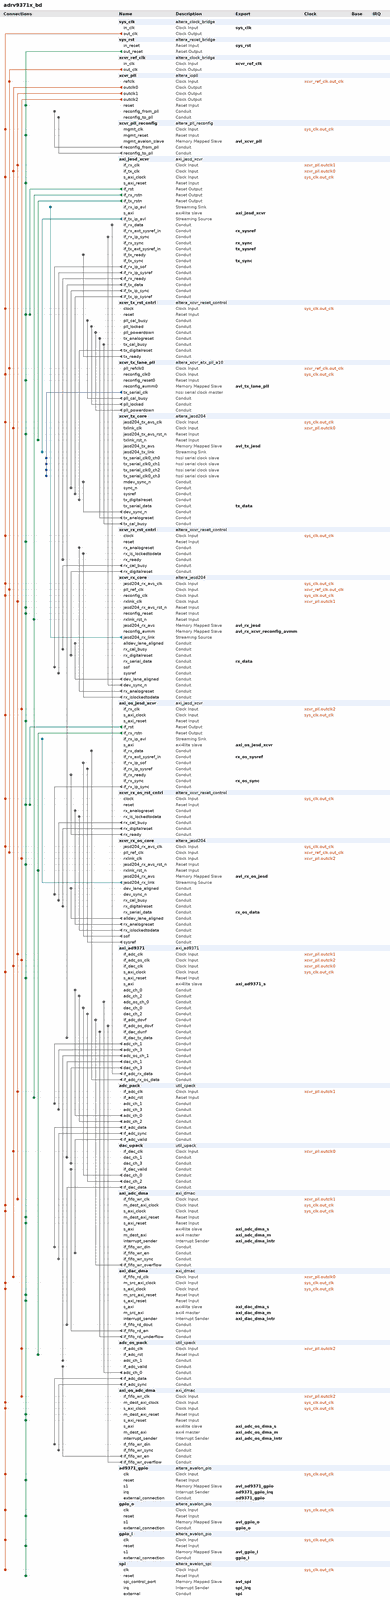
[diagram p0: system contents, whole]
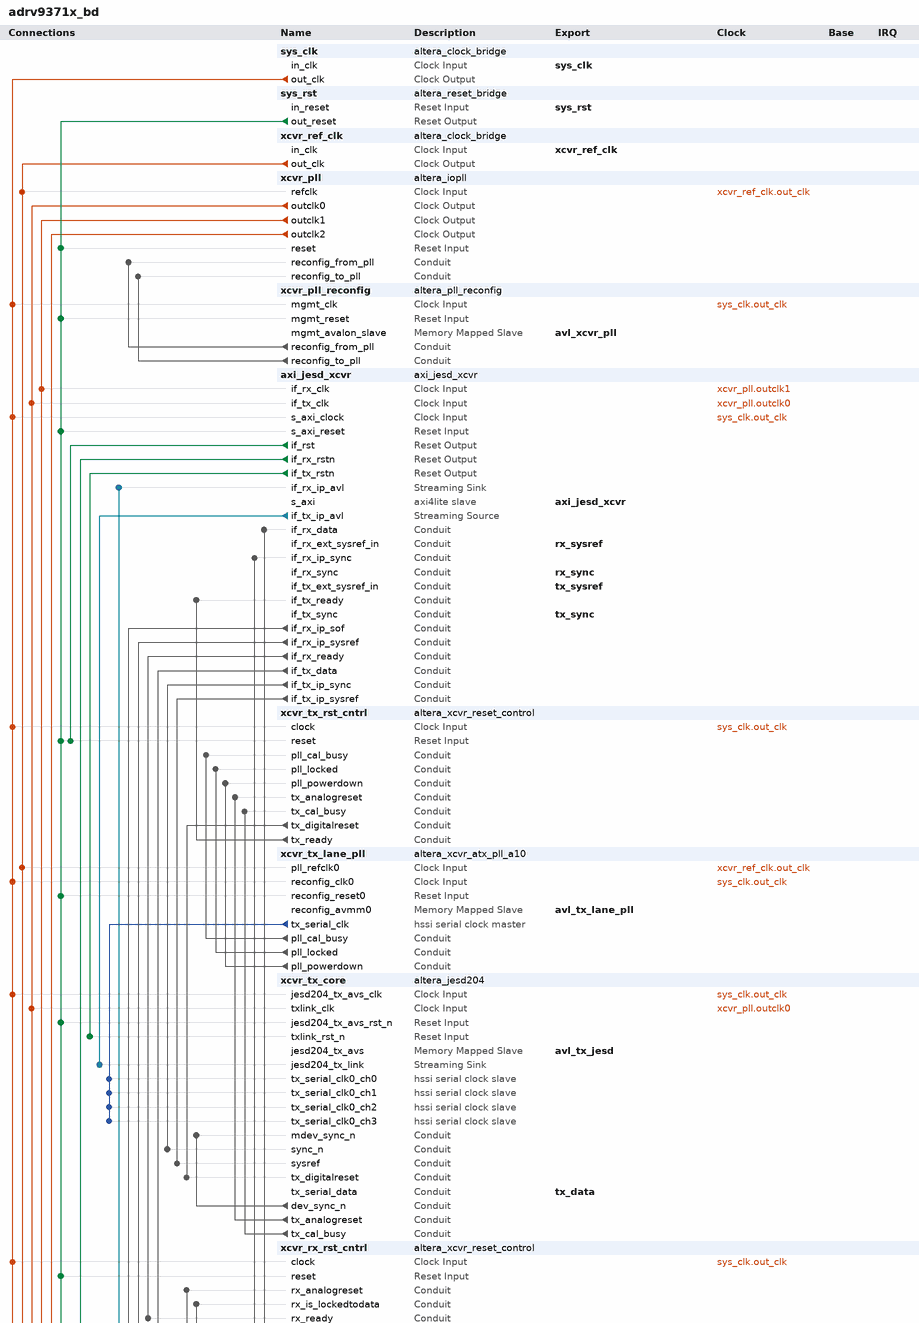
[diagram p1: system contents, upper part]
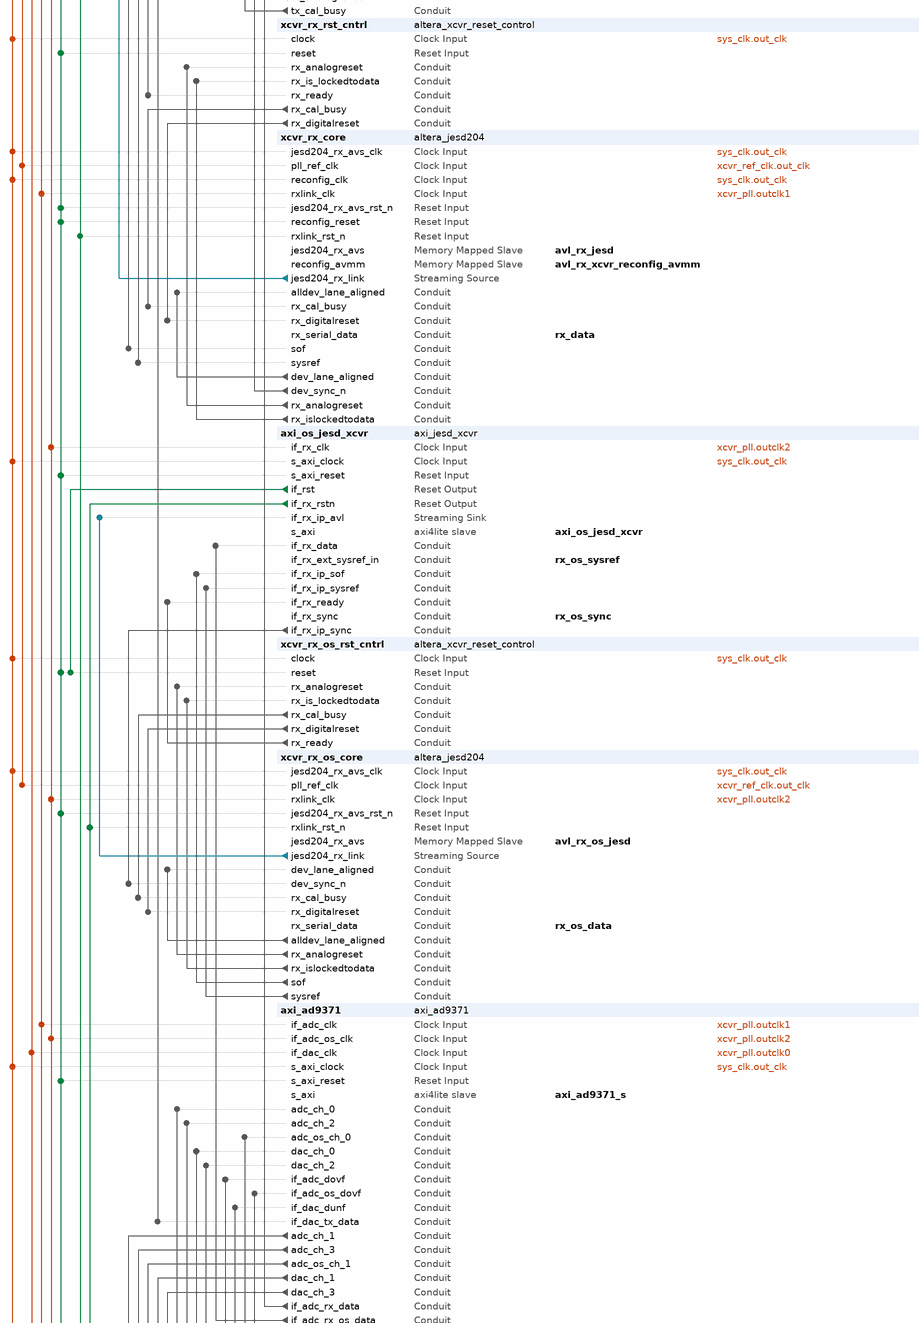
[diagram p2: system contents, middle part]
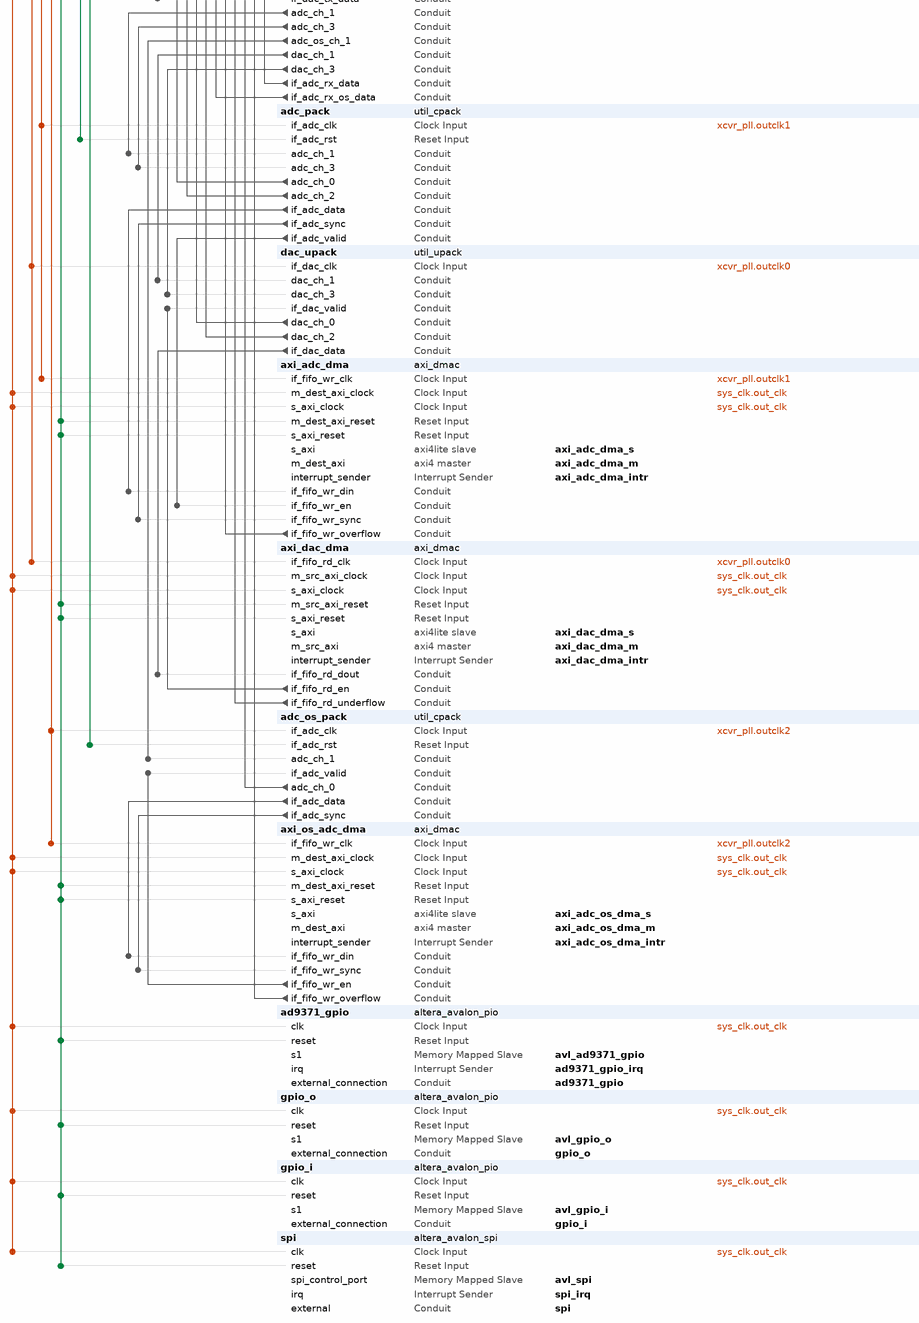
[diagram p3: system contents, lower part]
# Platform Designer (Qsys) system adrv9371x_bd, Arria 10 10AS066N3F40E2SGE2
# Parameters at their usual value, and those the tool derives, are not listed.
package require -exact qsys 15.1
create_system adrv9371x_bd
set_project_property DEVICE_FAMILY {Arria 10}
set_project_property DEVICE 10AS066N3F40E2SGE2

add_instance sys_clk altera_clock_bridge 15.1
set_instance_parameter_value sys_clk DERIVED_CLOCK_RATE 0
set_instance_parameter_value sys_clk EXPLICIT_CLOCK_RATE 50000000

add_instance sys_rst altera_reset_bridge 15.1
set_instance_parameter_value sys_rst ACTIVE_LOW_RESET 0
set_instance_parameter_value sys_rst SYNCHRONOUS_EDGES none

add_instance xcvr_ref_clk altera_clock_bridge 15.1
set_instance_parameter_value xcvr_ref_clk DERIVED_CLOCK_RATE 0
set_instance_parameter_value xcvr_ref_clk EXPLICIT_CLOCK_RATE 0

add_instance xcvr_pll altera_iopll 15.1
set_instance_parameter_value xcvr_pll gui_actual_duty_cycle0 50.0
set_instance_parameter_value xcvr_pll gui_actual_duty_cycle1 50.0
set_instance_parameter_value xcvr_pll gui_actual_duty_cycle2 50.0
set_instance_parameter_value xcvr_pll gui_actual_output_clock_frequency0 100.0
set_instance_parameter_value xcvr_pll gui_actual_output_clock_frequency1 100.0
set_instance_parameter_value xcvr_pll gui_actual_output_clock_frequency2 100.0
set_instance_parameter_value xcvr_pll gui_actual_phase_shift0 0.0
set_instance_parameter_value xcvr_pll gui_actual_phase_shift1 0.0
set_instance_parameter_value xcvr_pll gui_actual_phase_shift2 0.0
set_instance_parameter_value xcvr_pll gui_actual_phase_shift_deg0 0.0
set_instance_parameter_value xcvr_pll gui_actual_phase_shift_deg1 0.0
set_instance_parameter_value xcvr_pll gui_actual_phase_shift_deg2 0.0
set_instance_parameter_value xcvr_pll gui_clock_name_global0 false
set_instance_parameter_value xcvr_pll gui_clock_name_global1 false
set_instance_parameter_value xcvr_pll gui_clock_name_global2 false
set_instance_parameter_value xcvr_pll gui_clock_name_string0 tx_dac_clk
set_instance_parameter_value xcvr_pll gui_clock_name_string1 rx_adc_clk
set_instance_parameter_value xcvr_pll gui_clock_name_string2 rx_adc_os_clk
set_instance_parameter_value xcvr_pll gui_device_speed_grade 1
set_instance_parameter_value xcvr_pll gui_en_lvds_ports Disabled
set_instance_parameter_value xcvr_pll gui_en_reconf true
set_instance_parameter_value xcvr_pll gui_mif_generate false
set_instance_parameter_value xcvr_pll gui_number_of_clocks 3
set_instance_parameter_value xcvr_pll gui_operation_mode direct
set_instance_parameter_value xcvr_pll gui_output_clock_frequency0 122.88
set_instance_parameter_value xcvr_pll gui_output_clock_frequency1 122.88
set_instance_parameter_value xcvr_pll gui_output_clock_frequency2 122.88
set_instance_parameter_value xcvr_pll gui_reference_clock_frequency 122.88
set_instance_parameter_value xcvr_pll gui_use_NDFB_modes false
set_instance_parameter_value xcvr_pll gui_use_locked false
set_instance_parameter_value xcvr_pll gui_vco_frequency 600.0
set_instance_parameter_value xcvr_pll system_info_device_component 10AS066N3F40E2SGE2
set_instance_parameter_value xcvr_pll system_info_device_speed_grade 2
set_instance_parameter_value xcvr_pll system_part_trait_speed_grade 2

add_instance xcvr_pll_reconfig altera_pll_reconfig 15.1

add_instance axi_jesd_xcvr axi_jesd_xcvr 1.0
set_instance_parameter_value axi_jesd_xcvr DEVICE_TYPE 0
set_instance_parameter_value axi_jesd_xcvr ID 0
set_instance_parameter_value axi_jesd_xcvr RX_NUM_OF_LANES 2
set_instance_parameter_value axi_jesd_xcvr TX_NUM_OF_LANES 4

add_instance xcvr_tx_rst_cntrl altera_xcvr_reset_control 15.1
set_instance_parameter_value xcvr_tx_rst_cntrl CHANNELS 4
set_instance_parameter_value xcvr_tx_rst_cntrl RX_ENABLE 0
set_instance_parameter_value xcvr_tx_rst_cntrl RX_PER_CHANNEL 0
set_instance_parameter_value xcvr_tx_rst_cntrl SYS_CLK_IN_MHZ 100
set_instance_parameter_value xcvr_tx_rst_cntrl TX_PLL_ENABLE 1
set_instance_parameter_value xcvr_tx_rst_cntrl T_RX_ANALOGRESET 40
set_instance_parameter_value xcvr_tx_rst_cntrl T_TX_ANALOGRESET 70000
set_instance_parameter_value xcvr_tx_rst_cntrl T_TX_DIGITALRESET 70000
set_instance_parameter_value xcvr_tx_rst_cntrl gui_pll_cal_busy 1

add_instance xcvr_tx_lane_pll altera_xcvr_atx_pll_a10 15.1
set_instance_parameter_value xcvr_tx_lane_pll base_device NIGHTFURY4
set_instance_parameter_value xcvr_tx_lane_pll enable_analog_resets 0
set_instance_parameter_value xcvr_tx_lane_pll enable_atx_to_fpll_cascade_out 0
set_instance_parameter_value xcvr_tx_lane_pll enable_bonding_clks 0
set_instance_parameter_value xcvr_tx_lane_pll enable_fractional 0
set_instance_parameter_value xcvr_tx_lane_pll enable_manual_configuration 1
set_instance_parameter_value xcvr_tx_lane_pll enable_mcgb 0
set_instance_parameter_value xcvr_tx_lane_pll enable_pll_reconfig 1
set_instance_parameter_value xcvr_tx_lane_pll generate_docs 1
set_instance_parameter_value xcvr_tx_lane_pll pma_width 64
set_instance_parameter_value xcvr_tx_lane_pll rcfg_enable_avmm_busy_port 0
set_instance_parameter_value xcvr_tx_lane_pll rcfg_separate_avmm_busy 1
set_instance_parameter_value xcvr_tx_lane_pll select_manual_config false
set_instance_parameter_value xcvr_tx_lane_pll set_auto_reference_clock_frequency 122.88
set_instance_parameter_value xcvr_tx_lane_pll set_capability_reg_enable 1
set_instance_parameter_value xcvr_tx_lane_pll set_csr_soft_logic_enable 1
set_instance_parameter_value xcvr_tx_lane_pll set_fref_clock_frequency 156.25
set_instance_parameter_value xcvr_tx_lane_pll set_k_counter 2000000000
set_instance_parameter_value xcvr_tx_lane_pll set_l_cascade_counter 15
set_instance_parameter_value xcvr_tx_lane_pll set_l_cascade_predivider 1
set_instance_parameter_value xcvr_tx_lane_pll set_l_counter 16
set_instance_parameter_value xcvr_tx_lane_pll set_m_counter 24
set_instance_parameter_value xcvr_tx_lane_pll set_manual_reference_clock_frequency 200.0
set_instance_parameter_value xcvr_tx_lane_pll set_output_clock_frequency 2457.6

add_instance xcvr_tx_core altera_jesd204 15.1
set_instance_parameter_value xcvr_tx_core ADJCNT 0
set_instance_parameter_value xcvr_tx_core ADJDIR 0
set_instance_parameter_value xcvr_tx_core BID 0
set_instance_parameter_value xcvr_tx_core CF 0
set_instance_parameter_value xcvr_tx_core CS 0
set_instance_parameter_value xcvr_tx_core DATA_PATH TX
set_instance_parameter_value xcvr_tx_core DID 0
set_instance_parameter_value xcvr_tx_core DLB_TEST 0
set_instance_parameter_value xcvr_tx_core ECC_EN 0
set_instance_parameter_value xcvr_tx_core ED_DEV_KIT NONE
set_instance_parameter_value xcvr_tx_core ED_FILESET_SIM false
set_instance_parameter_value xcvr_tx_core ED_FILESET_SYNTH false
set_instance_parameter_value xcvr_tx_core ED_GENERIC_5SERIES No
set_instance_parameter_value xcvr_tx_core ED_GENERIC_A10 No
set_instance_parameter_value xcvr_tx_core ED_HDL_FORMAT_SIM VERILOG
set_instance_parameter_value xcvr_tx_core ED_HDL_FORMAT_SYNTH VERILOG
set_instance_parameter_value xcvr_tx_core GUI_CFG_F 4
set_instance_parameter_value xcvr_tx_core GUI_EN_CFG_F false
set_instance_parameter_value xcvr_tx_core HD 0
set_instance_parameter_value xcvr_tx_core JESDV 1
set_instance_parameter_value xcvr_tx_core K 32
set_instance_parameter_value xcvr_tx_core L 4
set_instance_parameter_value xcvr_tx_core LID0 0
set_instance_parameter_value xcvr_tx_core LID1 1
set_instance_parameter_value xcvr_tx_core LID2 2
set_instance_parameter_value xcvr_tx_core LID3 3
set_instance_parameter_value xcvr_tx_core LID4 4
set_instance_parameter_value xcvr_tx_core LID5 5
set_instance_parameter_value xcvr_tx_core LID6 6
set_instance_parameter_value xcvr_tx_core LID7 7
set_instance_parameter_value xcvr_tx_core M 4
set_instance_parameter_value xcvr_tx_core N 16
set_instance_parameter_value xcvr_tx_core N_PRIME 16
set_instance_parameter_value xcvr_tx_core OPTIMIZE 0
set_instance_parameter_value xcvr_tx_core PCS_CONFIG JESD_PCS_CFG1
set_instance_parameter_value xcvr_tx_core PHADJ 0
set_instance_parameter_value xcvr_tx_core REFCLK_FREQ 125.0
set_instance_parameter_value xcvr_tx_core RES1 0
set_instance_parameter_value xcvr_tx_core RES2 0
set_instance_parameter_value xcvr_tx_core S 1
set_instance_parameter_value xcvr_tx_core SCR 1
set_instance_parameter_value xcvr_tx_core SUBCLASSV 1
set_instance_parameter_value xcvr_tx_core TERMINATE_RECONFIG_EN false
set_instance_parameter_value xcvr_tx_core TEST_COMPONENTS_EN false
set_instance_parameter_value xcvr_tx_core bitrev_en false
set_instance_parameter_value xcvr_tx_core bonded_mode non_bonded
set_instance_parameter_value xcvr_tx_core lane_rate 4915.2
set_instance_parameter_value xcvr_tx_core part_trait_bd NIGHTFURY4
set_instance_parameter_value xcvr_tx_core part_trait_dp 10AS066N3F40E2SGE2
set_instance_parameter_value xcvr_tx_core pll_reconfig_enable false
set_instance_parameter_value xcvr_tx_core pll_type CMU
set_instance_parameter_value xcvr_tx_core rcfg_jtag_enable false
set_instance_parameter_value xcvr_tx_core sdc_constraint 1.0
set_instance_parameter_value xcvr_tx_core set_capability_reg_enable false
set_instance_parameter_value xcvr_tx_core set_csr_soft_logic_enable false
set_instance_parameter_value xcvr_tx_core set_prbs_soft_logic_enable false
set_instance_parameter_value xcvr_tx_core set_user_identifier 0
set_instance_parameter_value xcvr_tx_core wrapper_opt base_phy

add_instance xcvr_rx_rst_cntrl altera_xcvr_reset_control 15.1
set_instance_parameter_value xcvr_rx_rst_cntrl CHANNELS 2
set_instance_parameter_value xcvr_rx_rst_cntrl RX_PER_CHANNEL 0
set_instance_parameter_value xcvr_rx_rst_cntrl SYS_CLK_IN_MHZ 100
set_instance_parameter_value xcvr_rx_rst_cntrl TX_ENABLE 0
set_instance_parameter_value xcvr_rx_rst_cntrl TX_PLL_ENABLE 0
set_instance_parameter_value xcvr_rx_rst_cntrl T_RX_ANALOGRESET 70000
set_instance_parameter_value xcvr_rx_rst_cntrl T_TX_ANALOGRESET 70000
set_instance_parameter_value xcvr_rx_rst_cntrl T_TX_DIGITALRESET 70000
set_instance_parameter_value xcvr_rx_rst_cntrl gui_pll_cal_busy 1

add_instance xcvr_rx_core altera_jesd204 15.1
set_instance_parameter_value xcvr_rx_core ADJCNT 0
set_instance_parameter_value xcvr_rx_core ADJDIR 0
set_instance_parameter_value xcvr_rx_core BID 0
set_instance_parameter_value xcvr_rx_core CF 0
set_instance_parameter_value xcvr_rx_core CS 0
set_instance_parameter_value xcvr_rx_core DATA_PATH RX
set_instance_parameter_value xcvr_rx_core DID 0
set_instance_parameter_value xcvr_rx_core DLB_TEST 0
set_instance_parameter_value xcvr_rx_core ECC_EN 0
set_instance_parameter_value xcvr_rx_core ED_DEV_KIT NONE
set_instance_parameter_value xcvr_rx_core ED_FILESET_SIM false
set_instance_parameter_value xcvr_rx_core ED_FILESET_SYNTH false
set_instance_parameter_value xcvr_rx_core ED_GENERIC_5SERIES No
set_instance_parameter_value xcvr_rx_core ED_GENERIC_A10 No
set_instance_parameter_value xcvr_rx_core ED_HDL_FORMAT_SIM VERILOG
set_instance_parameter_value xcvr_rx_core ED_HDL_FORMAT_SYNTH VERILOG
set_instance_parameter_value xcvr_rx_core GUI_CFG_F 4
set_instance_parameter_value xcvr_rx_core GUI_EN_CFG_F false
set_instance_parameter_value xcvr_rx_core HD 0
set_instance_parameter_value xcvr_rx_core JESDV 1
set_instance_parameter_value xcvr_rx_core K 32
set_instance_parameter_value xcvr_rx_core L 2
set_instance_parameter_value xcvr_rx_core LID0 0
set_instance_parameter_value xcvr_rx_core LID1 1
set_instance_parameter_value xcvr_rx_core LID2 2
set_instance_parameter_value xcvr_rx_core LID3 3
set_instance_parameter_value xcvr_rx_core LID4 4
set_instance_parameter_value xcvr_rx_core LID5 5
set_instance_parameter_value xcvr_rx_core LID6 6
set_instance_parameter_value xcvr_rx_core LID7 7
set_instance_parameter_value xcvr_rx_core M 4
set_instance_parameter_value xcvr_rx_core N 16
set_instance_parameter_value xcvr_rx_core N_PRIME 16
set_instance_parameter_value xcvr_rx_core OPTIMIZE 0
set_instance_parameter_value xcvr_rx_core PCS_CONFIG JESD_PCS_CFG1
set_instance_parameter_value xcvr_rx_core PHADJ 0
set_instance_parameter_value xcvr_rx_core REFCLK_FREQ 122.88
set_instance_parameter_value xcvr_rx_core RES1 0
set_instance_parameter_value xcvr_rx_core RES2 0
set_instance_parameter_value xcvr_rx_core S 1
set_instance_parameter_value xcvr_rx_core SCR 1
set_instance_parameter_value xcvr_rx_core SUBCLASSV 1
set_instance_parameter_value xcvr_rx_core TERMINATE_RECONFIG_EN false
set_instance_parameter_value xcvr_rx_core TEST_COMPONENTS_EN false
set_instance_parameter_value xcvr_rx_core bitrev_en false
set_instance_parameter_value xcvr_rx_core bonded_mode non_bonded
set_instance_parameter_value xcvr_rx_core lane_rate 4915.2
set_instance_parameter_value xcvr_rx_core part_trait_bd NIGHTFURY4
set_instance_parameter_value xcvr_rx_core part_trait_dp 10AS066N3F40E2SGE2
set_instance_parameter_value xcvr_rx_core pll_reconfig_enable true
set_instance_parameter_value xcvr_rx_core pll_type CMU
set_instance_parameter_value xcvr_rx_core rcfg_jtag_enable false
set_instance_parameter_value xcvr_rx_core sdc_constraint 1.0
set_instance_parameter_value xcvr_rx_core set_capability_reg_enable true
set_instance_parameter_value xcvr_rx_core set_csr_soft_logic_enable false
set_instance_parameter_value xcvr_rx_core set_prbs_soft_logic_enable false
set_instance_parameter_value xcvr_rx_core set_user_identifier 0
set_instance_parameter_value xcvr_rx_core wrapper_opt base_phy

add_instance axi_os_jesd_xcvr axi_jesd_xcvr 1.0
set_instance_parameter_value axi_os_jesd_xcvr DEVICE_TYPE 0
set_instance_parameter_value axi_os_jesd_xcvr ID 1
set_instance_parameter_value axi_os_jesd_xcvr RX_NUM_OF_LANES 2
set_instance_parameter_value axi_os_jesd_xcvr TX_NUM_OF_LANES 0

add_instance xcvr_rx_os_rst_cntrl altera_xcvr_reset_control 15.1
set_instance_parameter_value xcvr_rx_os_rst_cntrl CHANNELS 2
set_instance_parameter_value xcvr_rx_os_rst_cntrl RX_PER_CHANNEL 0
set_instance_parameter_value xcvr_rx_os_rst_cntrl SYS_CLK_IN_MHZ 100
set_instance_parameter_value xcvr_rx_os_rst_cntrl TX_ENABLE 0
set_instance_parameter_value xcvr_rx_os_rst_cntrl TX_PLL_ENABLE 0
set_instance_parameter_value xcvr_rx_os_rst_cntrl T_RX_ANALOGRESET 70000
set_instance_parameter_value xcvr_rx_os_rst_cntrl T_TX_ANALOGRESET 70000
set_instance_parameter_value xcvr_rx_os_rst_cntrl T_TX_DIGITALRESET 70000
set_instance_parameter_value xcvr_rx_os_rst_cntrl gui_pll_cal_busy 1

add_instance xcvr_rx_os_core altera_jesd204 15.1
set_instance_parameter_value xcvr_rx_os_core ADJCNT 0
set_instance_parameter_value xcvr_rx_os_core ADJDIR 0
set_instance_parameter_value xcvr_rx_os_core BID 0
set_instance_parameter_value xcvr_rx_os_core CF 0
set_instance_parameter_value xcvr_rx_os_core CS 0
set_instance_parameter_value xcvr_rx_os_core DATA_PATH RX
set_instance_parameter_value xcvr_rx_os_core DID 0
set_instance_parameter_value xcvr_rx_os_core DLB_TEST 0
set_instance_parameter_value xcvr_rx_os_core ECC_EN 0
set_instance_parameter_value xcvr_rx_os_core ED_DEV_KIT NONE
set_instance_parameter_value xcvr_rx_os_core ED_FILESET_SIM false
set_instance_parameter_value xcvr_rx_os_core ED_FILESET_SYNTH false
set_instance_parameter_value xcvr_rx_os_core ED_GENERIC_5SERIES No
set_instance_parameter_value xcvr_rx_os_core ED_GENERIC_A10 No
set_instance_parameter_value xcvr_rx_os_core ED_HDL_FORMAT_SIM VERILOG
set_instance_parameter_value xcvr_rx_os_core ED_HDL_FORMAT_SYNTH VERILOG
set_instance_parameter_value xcvr_rx_os_core GUI_CFG_F 4
set_instance_parameter_value xcvr_rx_os_core GUI_EN_CFG_F false
set_instance_parameter_value xcvr_rx_os_core HD 0
set_instance_parameter_value xcvr_rx_os_core JESDV 1
set_instance_parameter_value xcvr_rx_os_core K 16
set_instance_parameter_value xcvr_rx_os_core L 2
set_instance_parameter_value xcvr_rx_os_core LID0 0
set_instance_parameter_value xcvr_rx_os_core LID1 1
set_instance_parameter_value xcvr_rx_os_core LID2 2
set_instance_parameter_value xcvr_rx_os_core LID3 3
set_instance_parameter_value xcvr_rx_os_core LID4 4
set_instance_parameter_value xcvr_rx_os_core LID5 5
set_instance_parameter_value xcvr_rx_os_core LID6 6
set_instance_parameter_value xcvr_rx_os_core LID7 7
set_instance_parameter_value xcvr_rx_os_core M 2
set_instance_parameter_value xcvr_rx_os_core N 16
set_instance_parameter_value xcvr_rx_os_core N_PRIME 16
set_instance_parameter_value xcvr_rx_os_core OPTIMIZE 0
set_instance_parameter_value xcvr_rx_os_core PCS_CONFIG JESD_PCS_CFG1
set_instance_parameter_value xcvr_rx_os_core PHADJ 0
set_instance_parameter_value xcvr_rx_os_core REFCLK_FREQ 122.88
set_instance_parameter_value xcvr_rx_os_core RES1 0
set_instance_parameter_value xcvr_rx_os_core RES2 0
set_instance_parameter_value xcvr_rx_os_core S 1
set_instance_parameter_value xcvr_rx_os_core SCR 1
set_instance_parameter_value xcvr_rx_os_core SUBCLASSV 1
set_instance_parameter_value xcvr_rx_os_core TERMINATE_RECONFIG_EN false
set_instance_parameter_value xcvr_rx_os_core TEST_COMPONENTS_EN false
set_instance_parameter_value xcvr_rx_os_core bitrev_en false
set_instance_parameter_value xcvr_rx_os_core bonded_mode non_bonded
set_instance_parameter_value xcvr_rx_os_core lane_rate 4915.2
set_instance_parameter_value xcvr_rx_os_core part_trait_bd NIGHTFURY4
set_instance_parameter_value xcvr_rx_os_core part_trait_dp 10AS066N3F40E2SGE2
set_instance_parameter_value xcvr_rx_os_core pll_reconfig_enable false
set_instance_parameter_value xcvr_rx_os_core pll_type CMU
set_instance_parameter_value xcvr_rx_os_core rcfg_jtag_enable false
set_instance_parameter_value xcvr_rx_os_core sdc_constraint 1.0
set_instance_parameter_value xcvr_rx_os_core set_capability_reg_enable false
set_instance_parameter_value xcvr_rx_os_core set_csr_soft_logic_enable false
set_instance_parameter_value xcvr_rx_os_core set_prbs_soft_logic_enable false
set_instance_parameter_value xcvr_rx_os_core set_user_identifier 0
set_instance_parameter_value xcvr_rx_os_core wrapper_opt base_phy

add_instance axi_ad9371 axi_ad9371 1.0
set_instance_parameter_value axi_ad9371 ADC_DATAPATH_DISABLE 0
set_instance_parameter_value axi_ad9371 DAC_DATAPATH_DISABLE 0
set_instance_parameter_value axi_ad9371 ID 0

add_instance adc_pack util_cpack 1.0
set_instance_parameter_value adc_pack CHANNEL_DATA_WIDTH 16
set_instance_parameter_value adc_pack NUM_OF_CHANNELS 4

add_instance dac_upack util_upack 1.0
set_instance_parameter_value dac_upack CHANNEL_DATA_WIDTH 32
set_instance_parameter_value dac_upack NUM_OF_CHANNELS 4

add_instance axi_adc_dma axi_dmac 1.0
set_instance_parameter_value axi_adc_dma ASYNC_CLK_DEST_REQ 1
set_instance_parameter_value axi_adc_dma ASYNC_CLK_REQ_SRC 1
set_instance_parameter_value axi_adc_dma ASYNC_CLK_SRC_DEST 1
set_instance_parameter_value axi_adc_dma AXI_SLICE_DEST 0
set_instance_parameter_value axi_adc_dma AXI_SLICE_SRC 0
set_instance_parameter_value axi_adc_dma CYCLIC 0
set_instance_parameter_value axi_adc_dma DMA_2D_TRANSFER 0
set_instance_parameter_value axi_adc_dma DMA_DATA_WIDTH_DEST 64
set_instance_parameter_value axi_adc_dma DMA_DATA_WIDTH_SRC 64
set_instance_parameter_value axi_adc_dma DMA_LENGTH_WIDTH 24
set_instance_parameter_value axi_adc_dma DMA_TYPE_DEST 0
set_instance_parameter_value axi_adc_dma DMA_TYPE_SRC 2
set_instance_parameter_value axi_adc_dma FIFO_SIZE 4
set_instance_parameter_value axi_adc_dma ID 0
set_instance_parameter_value axi_adc_dma SYNC_TRANSFER_START 1

add_instance axi_dac_dma axi_dmac 1.0
set_instance_parameter_value axi_dac_dma ASYNC_CLK_DEST_REQ 1
set_instance_parameter_value axi_dac_dma ASYNC_CLK_REQ_SRC 1
set_instance_parameter_value axi_dac_dma ASYNC_CLK_SRC_DEST 1
set_instance_parameter_value axi_dac_dma AXI_SLICE_DEST 0
set_instance_parameter_value axi_dac_dma AXI_SLICE_SRC 0
set_instance_parameter_value axi_dac_dma CYCLIC 1
set_instance_parameter_value axi_dac_dma DMA_2D_TRANSFER 0
set_instance_parameter_value axi_dac_dma DMA_DATA_WIDTH_DEST 128
set_instance_parameter_value axi_dac_dma DMA_DATA_WIDTH_SRC 128
set_instance_parameter_value axi_dac_dma DMA_LENGTH_WIDTH 24
set_instance_parameter_value axi_dac_dma DMA_TYPE_DEST 2
set_instance_parameter_value axi_dac_dma DMA_TYPE_SRC 0
set_instance_parameter_value axi_dac_dma FIFO_SIZE 4
set_instance_parameter_value axi_dac_dma ID 0
set_instance_parameter_value axi_dac_dma SYNC_TRANSFER_START 0

add_instance adc_os_pack util_cpack 1.0
set_instance_parameter_value adc_os_pack CHANNEL_DATA_WIDTH 32
set_instance_parameter_value adc_os_pack NUM_OF_CHANNELS 2

add_instance axi_os_adc_dma axi_dmac 1.0
set_instance_parameter_value axi_os_adc_dma ASYNC_CLK_DEST_REQ 1
set_instance_parameter_value axi_os_adc_dma ASYNC_CLK_REQ_SRC 1
set_instance_parameter_value axi_os_adc_dma ASYNC_CLK_SRC_DEST 1
set_instance_parameter_value axi_os_adc_dma AXI_SLICE_DEST 0
set_instance_parameter_value axi_os_adc_dma AXI_SLICE_SRC 0
set_instance_parameter_value axi_os_adc_dma CYCLIC 0
set_instance_parameter_value axi_os_adc_dma DMA_2D_TRANSFER 0
set_instance_parameter_value axi_os_adc_dma DMA_DATA_WIDTH_DEST 64
set_instance_parameter_value axi_os_adc_dma DMA_DATA_WIDTH_SRC 64
set_instance_parameter_value axi_os_adc_dma DMA_LENGTH_WIDTH 24
set_instance_parameter_value axi_os_adc_dma DMA_TYPE_DEST 0
set_instance_parameter_value axi_os_adc_dma DMA_TYPE_SRC 2
set_instance_parameter_value axi_os_adc_dma FIFO_SIZE 4
set_instance_parameter_value axi_os_adc_dma ID 0
set_instance_parameter_value axi_os_adc_dma SYNC_TRANSFER_START 1

add_instance ad9371_gpio altera_avalon_pio 15.1
set_instance_parameter_value ad9371_gpio bitModifyingOutReg true
set_instance_parameter_value ad9371_gpio direction Bidir
set_instance_parameter_value ad9371_gpio generateIRQ true
set_instance_parameter_value ad9371_gpio width 19

add_instance gpio_o altera_avalon_pio 15.1
set_instance_parameter_value gpio_o bitModifyingOutReg true
set_instance_parameter_value gpio_o direction Output
set_instance_parameter_value gpio_o width 32

add_instance gpio_i altera_avalon_pio 15.1
set_instance_parameter_value gpio_i direction Input
set_instance_parameter_value gpio_i width 32

add_instance spi altera_avalon_spi 15.1
set_instance_parameter_value spi clockPhase 1
set_instance_parameter_value spi clockPolarity 1
set_instance_parameter_value spi dataWidth 8
set_instance_parameter_value spi masterSPI true
set_instance_parameter_value spi numberOfSlaves 2
set_instance_parameter_value spi targetClockRate 5000000

# connections
add_connection sys_clk.out_clk ad9371_gpio.clk clock
add_connection sys_clk.out_clk axi_ad9371.s_axi_clock clock
add_connection sys_clk.out_clk axi_adc_dma.m_dest_axi_clock clock
add_connection sys_clk.out_clk axi_adc_dma.s_axi_clock clock
add_connection sys_clk.out_clk axi_dac_dma.m_src_axi_clock clock
add_connection sys_clk.out_clk axi_dac_dma.s_axi_clock clock
add_connection sys_clk.out_clk axi_jesd_xcvr.s_axi_clock clock
add_connection sys_clk.out_clk axi_os_adc_dma.m_dest_axi_clock clock
add_connection sys_clk.out_clk axi_os_adc_dma.s_axi_clock clock
add_connection sys_clk.out_clk axi_os_jesd_xcvr.s_axi_clock clock
add_connection sys_clk.out_clk gpio_i.clk clock
add_connection sys_clk.out_clk gpio_o.clk clock
add_connection sys_clk.out_clk spi.clk clock
add_connection sys_clk.out_clk xcvr_pll_reconfig.mgmt_clk clock
add_connection sys_clk.out_clk xcvr_rx_core.jesd204_rx_avs_clk clock
add_connection sys_clk.out_clk xcvr_rx_core.reconfig_clk clock
add_connection sys_clk.out_clk xcvr_rx_os_core.jesd204_rx_avs_clk clock
add_connection sys_clk.out_clk xcvr_rx_os_rst_cntrl.clock clock
add_connection sys_clk.out_clk xcvr_rx_rst_cntrl.clock clock
add_connection sys_clk.out_clk xcvr_tx_core.jesd204_tx_avs_clk clock
add_connection sys_clk.out_clk xcvr_tx_lane_pll.reconfig_clk0 clock
add_connection sys_clk.out_clk xcvr_tx_rst_cntrl.clock clock
add_connection xcvr_pll.outclk0 axi_ad9371.if_dac_clk clock
add_connection xcvr_pll.outclk0 axi_dac_dma.if_fifo_rd_clk clock
add_connection xcvr_pll.outclk0 axi_jesd_xcvr.if_tx_clk clock
add_connection xcvr_pll.outclk0 dac_upack.if_dac_clk clock
add_connection xcvr_pll.outclk0 xcvr_tx_core.txlink_clk clock
add_connection xcvr_pll.outclk1 adc_pack.if_adc_clk clock
add_connection xcvr_pll.outclk1 axi_ad9371.if_adc_clk clock
add_connection xcvr_pll.outclk1 axi_adc_dma.if_fifo_wr_clk clock
add_connection xcvr_pll.outclk1 axi_jesd_xcvr.if_rx_clk clock
add_connection xcvr_pll.outclk1 xcvr_rx_core.rxlink_clk clock
add_connection xcvr_pll.outclk2 adc_os_pack.if_adc_clk clock
add_connection xcvr_pll.outclk2 axi_ad9371.if_adc_os_clk clock
add_connection xcvr_pll.outclk2 axi_os_adc_dma.if_fifo_wr_clk clock
add_connection xcvr_pll.outclk2 axi_os_jesd_xcvr.if_rx_clk clock
add_connection xcvr_pll.outclk2 xcvr_rx_os_core.rxlink_clk clock
add_connection xcvr_ref_clk.out_clk xcvr_pll.refclk clock
add_connection xcvr_ref_clk.out_clk xcvr_rx_core.pll_ref_clk clock
add_connection xcvr_ref_clk.out_clk xcvr_rx_os_core.pll_ref_clk clock
add_connection xcvr_ref_clk.out_clk xcvr_tx_lane_pll.pll_refclk0 clock
add_connection axi_jesd_xcvr.if_rst xcvr_tx_rst_cntrl.reset reset
add_connection axi_jesd_xcvr.if_rx_rstn adc_pack.if_adc_rst reset
add_connection axi_jesd_xcvr.if_rx_rstn xcvr_rx_core.rxlink_rst_n reset
add_connection axi_jesd_xcvr.if_tx_rstn xcvr_tx_core.txlink_rst_n reset
add_connection axi_os_jesd_xcvr.if_rst xcvr_rx_os_rst_cntrl.reset reset
add_connection axi_os_jesd_xcvr.if_rx_rstn adc_os_pack.if_adc_rst reset
add_connection axi_os_jesd_xcvr.if_rx_rstn xcvr_rx_os_core.rxlink_rst_n reset
add_connection sys_rst.out_reset ad9371_gpio.reset reset
add_connection sys_rst.out_reset axi_ad9371.s_axi_reset reset
add_connection sys_rst.out_reset axi_adc_dma.m_dest_axi_reset reset
add_connection sys_rst.out_reset axi_adc_dma.s_axi_reset reset
add_connection sys_rst.out_reset axi_dac_dma.m_src_axi_reset reset
add_connection sys_rst.out_reset axi_dac_dma.s_axi_reset reset
add_connection sys_rst.out_reset axi_jesd_xcvr.s_axi_reset reset
add_connection sys_rst.out_reset axi_os_adc_dma.m_dest_axi_reset reset
add_connection sys_rst.out_reset axi_os_adc_dma.s_axi_reset reset
add_connection sys_rst.out_reset axi_os_jesd_xcvr.s_axi_reset reset
add_connection sys_rst.out_reset gpio_i.reset reset
add_connection sys_rst.out_reset gpio_o.reset reset
add_connection sys_rst.out_reset spi.reset reset
add_connection sys_rst.out_reset xcvr_pll.reset reset
add_connection sys_rst.out_reset xcvr_pll_reconfig.mgmt_reset reset
add_connection sys_rst.out_reset xcvr_rx_core.jesd204_rx_avs_rst_n reset
add_connection sys_rst.out_reset xcvr_rx_core.reconfig_reset reset
add_connection sys_rst.out_reset xcvr_rx_os_core.jesd204_rx_avs_rst_n reset
add_connection sys_rst.out_reset xcvr_rx_os_rst_cntrl.reset reset
add_connection sys_rst.out_reset xcvr_rx_rst_cntrl.reset reset
add_connection sys_rst.out_reset xcvr_tx_core.jesd204_tx_avs_rst_n reset
add_connection sys_rst.out_reset xcvr_tx_lane_pll.reconfig_reset0 reset
add_connection sys_rst.out_reset xcvr_tx_rst_cntrl.reset reset
add_connection axi_jesd_xcvr.if_tx_ip_avl xcvr_tx_core.jesd204_tx_link avalon_streaming
add_connection xcvr_rx_core.jesd204_rx_link axi_jesd_xcvr.if_rx_ip_avl avalon_streaming
add_connection xcvr_rx_os_core.jesd204_rx_link axi_os_jesd_xcvr.if_rx_ip_avl avalon_streaming
add_connection adc_os_pack.adc_ch_0 axi_ad9371.adc_os_ch_0 conduit
add_connection adc_os_pack.if_adc_data axi_os_adc_dma.if_fifo_wr_din conduit
add_connection adc_os_pack.if_adc_sync axi_os_adc_dma.if_fifo_wr_sync conduit
add_connection adc_pack.adc_ch_0 axi_ad9371.adc_ch_0 conduit
add_connection adc_pack.adc_ch_2 axi_ad9371.adc_ch_2 conduit
add_connection adc_pack.if_adc_data axi_adc_dma.if_fifo_wr_din conduit
add_connection adc_pack.if_adc_sync axi_adc_dma.if_fifo_wr_sync conduit
add_connection adc_pack.if_adc_valid axi_adc_dma.if_fifo_wr_en conduit
add_connection axi_ad9371.adc_ch_1 adc_pack.adc_ch_1 conduit
add_connection axi_ad9371.adc_ch_3 adc_pack.adc_ch_3 conduit
add_connection axi_ad9371.adc_os_ch_1 adc_os_pack.adc_ch_1 conduit
add_connection axi_ad9371.dac_ch_1 dac_upack.dac_ch_1 conduit
add_connection axi_ad9371.dac_ch_3 dac_upack.dac_ch_3 conduit
add_connection axi_ad9371.if_adc_rx_data axi_jesd_xcvr.if_rx_data conduit
add_connection axi_ad9371.if_adc_rx_os_data axi_os_jesd_xcvr.if_rx_data conduit
add_connection axi_adc_dma.if_fifo_wr_overflow axi_ad9371.if_adc_dovf conduit
add_connection axi_dac_dma.if_fifo_rd_en dac_upack.if_dac_valid conduit
add_connection axi_dac_dma.if_fifo_rd_underflow axi_ad9371.if_dac_dunf conduit
add_connection axi_jesd_xcvr.if_rx_ip_sof xcvr_rx_core.sof conduit
add_connection axi_jesd_xcvr.if_rx_ip_sysref xcvr_rx_core.sysref conduit
add_connection axi_jesd_xcvr.if_rx_ready xcvr_rx_rst_cntrl.rx_ready conduit
add_connection axi_jesd_xcvr.if_tx_data axi_ad9371.if_dac_tx_data conduit
add_connection axi_jesd_xcvr.if_tx_ip_sync xcvr_tx_core.sync_n conduit
add_connection axi_jesd_xcvr.if_tx_ip_sysref xcvr_tx_core.sysref conduit
add_connection axi_os_adc_dma.if_fifo_wr_en adc_os_pack.if_adc_valid conduit
add_connection axi_os_adc_dma.if_fifo_wr_overflow axi_ad9371.if_adc_os_dovf conduit
add_connection axi_os_jesd_xcvr.if_rx_ip_sync xcvr_rx_os_core.dev_sync_n conduit
add_connection dac_upack.dac_ch_0 axi_ad9371.dac_ch_0 conduit
add_connection dac_upack.dac_ch_2 axi_ad9371.dac_ch_2 conduit
add_connection dac_upack.if_dac_data axi_dac_dma.if_fifo_rd_dout conduit
add_connection xcvr_pll_reconfig.reconfig_from_pll xcvr_pll.reconfig_from_pll conduit
add_connection xcvr_pll_reconfig.reconfig_to_pll xcvr_pll.reconfig_to_pll conduit
add_connection xcvr_rx_core.dev_lane_aligned xcvr_rx_core.alldev_lane_aligned conduit
add_connection xcvr_rx_core.dev_sync_n axi_jesd_xcvr.if_rx_ip_sync conduit
add_connection xcvr_rx_core.rx_analogreset xcvr_rx_rst_cntrl.rx_analogreset conduit
add_connection xcvr_rx_core.rx_islockedtodata xcvr_rx_rst_cntrl.rx_is_lockedtodata conduit
add_connection xcvr_rx_os_core.alldev_lane_aligned xcvr_rx_os_core.dev_lane_aligned conduit
add_connection xcvr_rx_os_core.rx_analogreset xcvr_rx_os_rst_cntrl.rx_analogreset conduit
add_connection xcvr_rx_os_core.rx_islockedtodata xcvr_rx_os_rst_cntrl.rx_is_lockedtodata conduit
add_connection xcvr_rx_os_core.sof axi_os_jesd_xcvr.if_rx_ip_sof conduit
add_connection xcvr_rx_os_core.sysref axi_os_jesd_xcvr.if_rx_ip_sysref conduit
add_connection xcvr_rx_os_rst_cntrl.rx_cal_busy xcvr_rx_os_core.rx_cal_busy conduit
add_connection xcvr_rx_os_rst_cntrl.rx_digitalreset xcvr_rx_os_core.rx_digitalreset conduit
add_connection xcvr_rx_os_rst_cntrl.rx_ready axi_os_jesd_xcvr.if_rx_ready conduit
add_connection xcvr_rx_rst_cntrl.rx_cal_busy xcvr_rx_core.rx_cal_busy conduit
add_connection xcvr_rx_rst_cntrl.rx_digitalreset xcvr_rx_core.rx_digitalreset conduit
add_connection xcvr_tx_core.dev_sync_n xcvr_tx_core.mdev_sync_n conduit
add_connection xcvr_tx_core.tx_analogreset xcvr_tx_rst_cntrl.tx_analogreset conduit
add_connection xcvr_tx_core.tx_cal_busy xcvr_tx_rst_cntrl.tx_cal_busy conduit
add_connection xcvr_tx_lane_pll.pll_cal_busy xcvr_tx_rst_cntrl.pll_cal_busy conduit
add_connection xcvr_tx_lane_pll.pll_locked xcvr_tx_rst_cntrl.pll_locked conduit
add_connection xcvr_tx_lane_pll.pll_powerdown xcvr_tx_rst_cntrl.pll_powerdown conduit
add_connection xcvr_tx_rst_cntrl.tx_digitalreset xcvr_tx_core.tx_digitalreset conduit
add_connection xcvr_tx_rst_cntrl.tx_ready axi_jesd_xcvr.if_tx_ready conduit
add_connection xcvr_tx_lane_pll.tx_serial_clk xcvr_tx_core.tx_serial_clk0_ch0 hssi_serial_clock
add_connection xcvr_tx_lane_pll.tx_serial_clk xcvr_tx_core.tx_serial_clk0_ch1 hssi_serial_clock
add_connection xcvr_tx_lane_pll.tx_serial_clk xcvr_tx_core.tx_serial_clk0_ch2 hssi_serial_clock
add_connection xcvr_tx_lane_pll.tx_serial_clk xcvr_tx_core.tx_serial_clk0_ch3 hssi_serial_clock

# exported interfaces
add_interface ad9371_gpio conduit end
set_interface_property ad9371_gpio EXPORT_OF ad9371_gpio.external_connection
add_interface ad9371_gpio_irq interrupt sender
set_interface_property ad9371_gpio_irq EXPORT_OF ad9371_gpio.irq
add_interface avl_ad9371_gpio avalon slave
set_interface_property avl_ad9371_gpio EXPORT_OF ad9371_gpio.s1
add_interface avl_gpio_i avalon slave
set_interface_property avl_gpio_i EXPORT_OF gpio_i.s1
add_interface avl_gpio_o avalon slave
set_interface_property avl_gpio_o EXPORT_OF gpio_o.s1
add_interface avl_rx_jesd avalon slave
set_interface_property avl_rx_jesd EXPORT_OF xcvr_rx_core.jesd204_rx_avs
add_interface avl_rx_os_jesd avalon slave
set_interface_property avl_rx_os_jesd EXPORT_OF xcvr_rx_os_core.jesd204_rx_avs
add_interface avl_rx_xcvr_reconfig_avmm avalon slave
set_interface_property avl_rx_xcvr_reconfig_avmm EXPORT_OF xcvr_rx_core.reconfig_avmm
add_interface avl_spi avalon slave
set_interface_property avl_spi EXPORT_OF spi.spi_control_port
add_interface avl_tx_jesd avalon slave
set_interface_property avl_tx_jesd EXPORT_OF xcvr_tx_core.jesd204_tx_avs
add_interface avl_tx_lane_pll avalon slave
set_interface_property avl_tx_lane_pll EXPORT_OF xcvr_tx_lane_pll.reconfig_avmm0
add_interface avl_xcvr_pll avalon slave
set_interface_property avl_xcvr_pll EXPORT_OF xcvr_pll_reconfig.mgmt_avalon_slave
add_interface axi_ad9371_s axi4lite slave
set_interface_property axi_ad9371_s EXPORT_OF axi_ad9371.s_axi
add_interface axi_adc_dma_intr interrupt sender
set_interface_property axi_adc_dma_intr EXPORT_OF axi_adc_dma.interrupt_sender
add_interface axi_adc_dma_m axi4 master
set_interface_property axi_adc_dma_m EXPORT_OF axi_adc_dma.m_dest_axi
add_interface axi_adc_dma_s axi4lite slave
set_interface_property axi_adc_dma_s EXPORT_OF axi_adc_dma.s_axi
add_interface axi_adc_os_dma_intr interrupt sender
set_interface_property axi_adc_os_dma_intr EXPORT_OF axi_os_adc_dma.interrupt_sender
add_interface axi_adc_os_dma_m axi4 master
set_interface_property axi_adc_os_dma_m EXPORT_OF axi_os_adc_dma.m_dest_axi
add_interface axi_adc_os_dma_s axi4lite slave
set_interface_property axi_adc_os_dma_s EXPORT_OF axi_os_adc_dma.s_axi
add_interface axi_dac_dma_intr interrupt sender
set_interface_property axi_dac_dma_intr EXPORT_OF axi_dac_dma.interrupt_sender
add_interface axi_dac_dma_m axi4 master
set_interface_property axi_dac_dma_m EXPORT_OF axi_dac_dma.m_src_axi
add_interface axi_dac_dma_s axi4lite slave
set_interface_property axi_dac_dma_s EXPORT_OF axi_dac_dma.s_axi
add_interface axi_jesd_xcvr axi4lite slave
set_interface_property axi_jesd_xcvr EXPORT_OF axi_jesd_xcvr.s_axi
add_interface axi_os_jesd_xcvr axi4lite slave
set_interface_property axi_os_jesd_xcvr EXPORT_OF axi_os_jesd_xcvr.s_axi
add_interface gpio_i conduit end
set_interface_property gpio_i EXPORT_OF gpio_i.external_connection
add_interface gpio_o conduit end
set_interface_property gpio_o EXPORT_OF gpio_o.external_connection
add_interface rx_data conduit end
set_interface_property rx_data EXPORT_OF xcvr_rx_core.rx_serial_data
add_interface rx_os_data conduit end
set_interface_property rx_os_data EXPORT_OF xcvr_rx_os_core.rx_serial_data
add_interface rx_os_sync conduit end
set_interface_property rx_os_sync EXPORT_OF axi_os_jesd_xcvr.if_rx_sync
add_interface rx_os_sysref conduit end
set_interface_property rx_os_sysref EXPORT_OF axi_os_jesd_xcvr.if_rx_ext_sysref_in
add_interface rx_sync conduit end
set_interface_property rx_sync EXPORT_OF axi_jesd_xcvr.if_rx_sync
add_interface rx_sysref conduit end
set_interface_property rx_sysref EXPORT_OF axi_jesd_xcvr.if_rx_ext_sysref_in
add_interface spi conduit end
set_interface_property spi EXPORT_OF spi.external
add_interface spi_irq interrupt sender
set_interface_property spi_irq EXPORT_OF spi.irq
add_interface sys_clk clock sink
set_interface_property sys_clk EXPORT_OF sys_clk.in_clk
add_interface sys_rst reset sink
set_interface_property sys_rst EXPORT_OF sys_rst.in_reset
add_interface tx_data conduit end
set_interface_property tx_data EXPORT_OF xcvr_tx_core.tx_serial_data
add_interface tx_sync conduit end
set_interface_property tx_sync EXPORT_OF axi_jesd_xcvr.if_tx_sync
add_interface tx_sysref conduit end
set_interface_property tx_sysref EXPORT_OF axi_jesd_xcvr.if_tx_ext_sysref_in
add_interface xcvr_ref_clk clock sink
set_interface_property xcvr_ref_clk EXPORT_OF xcvr_ref_clk.in_clk

set_interconnect_requirement {$system} qsys_mm.clockCrossingAdapter FIFO
set_interconnect_requirement {$system} qsys_mm.maxAdditionalLatency 2
set_interconnect_requirement {mm_interconnect_0|cmd_mux} qsys_mm.postTransform.pipelineCount 0
set_interconnect_requirement {mm_interconnect_2|cmd_mux} qsys_mm.postTransform.pipelineCount 0
set_interconnect_requirement {mm_interconnect_3|cmd_mux} qsys_mm.postTransform.pipelineCount 0
set_interconnect_requirement {mm_interconnect_3|cmd_mux_001} qsys_mm.postTransform.pipelineCount 0
set_interconnect_requirement {mm_interconnect_4|axi_dmac_dac_m_src_axi_agent.write_cp/router.sink} qsys_mm.postTransform.pipelineCount 0
set_interconnect_requirement {mm_interconnect_4|cmd_mux} qsys_mm.postTransform.pipelineCount 0
set_interconnect_requirement {mm_interconnect_4|cmd_mux_001} qsys_mm.postTransform.pipelineCount 0

save_system adrv9371x_bd.qsys
